# Altium project Doom_computer_PCB.PrjPcb
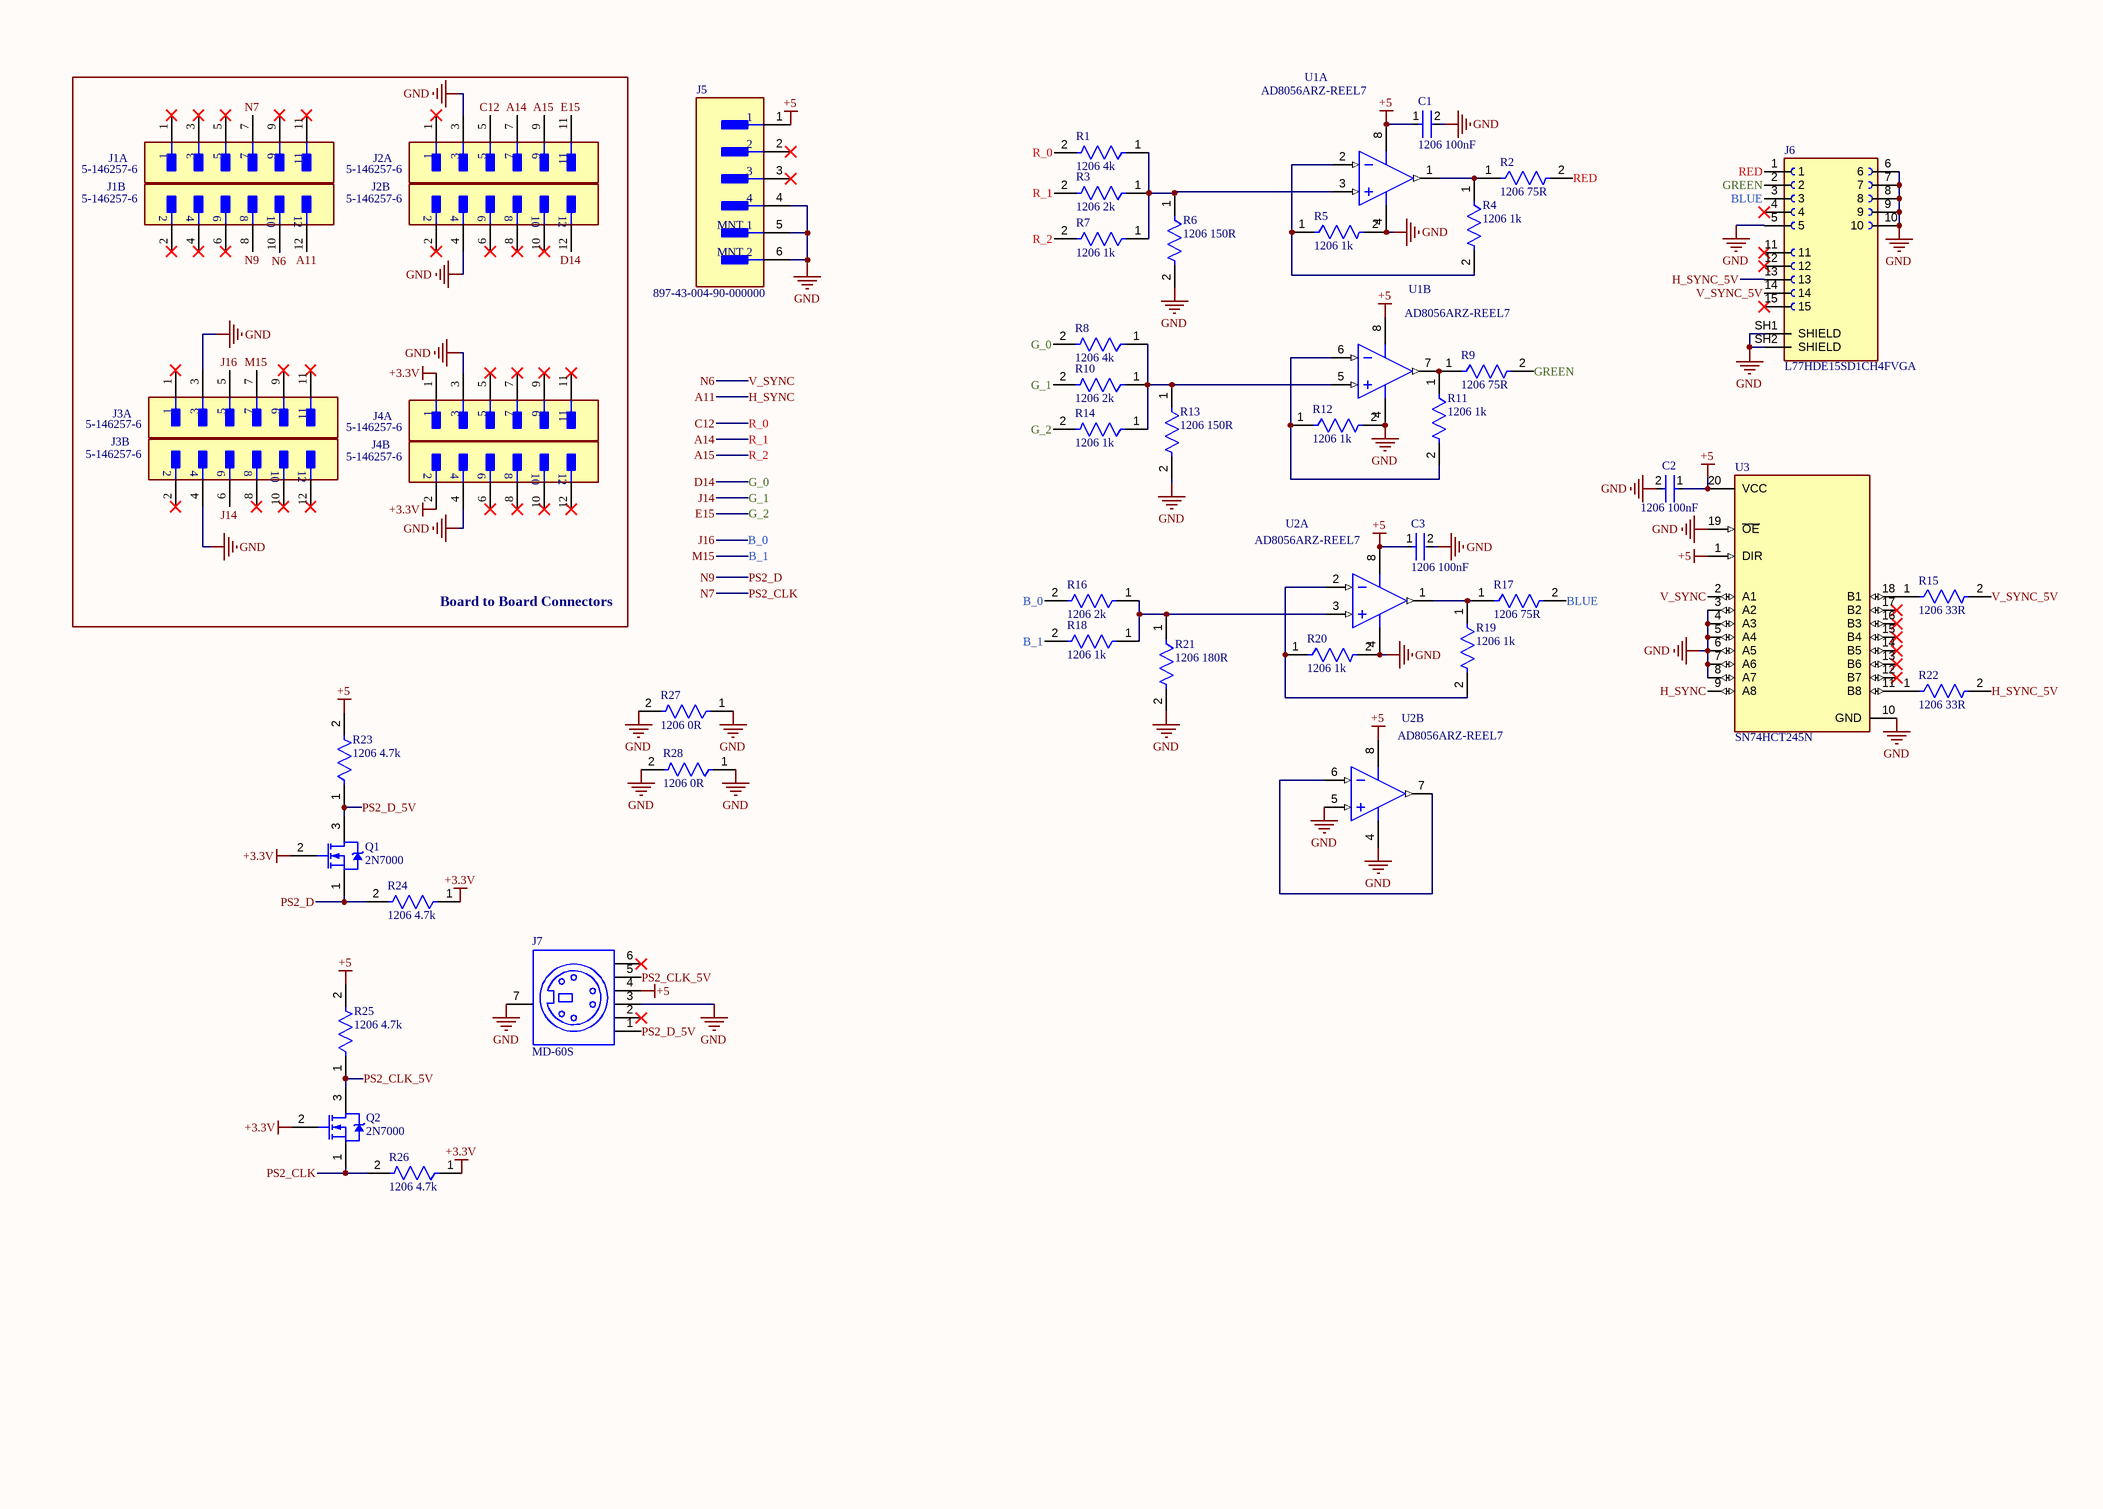
[diagram p0: Main.SchDoc]
1 sheet, 43 parts. Net scope: global (net labels, ports and power ports of the same name join across sheets).
Board file: PCB1.PcbDoc

## Sheet Main.SchDoc
size A3; SheetNumber: 1; SheetTotal: 1

### Parts
C1  1206 100nF  [FP-1206-L_3_2_0_2-W_1_6_0-MFG]
C2  1206 100nF  [FP-1206-L_3_2_0_2-W_1_6_0-MFG]
C3  1206 100nF  [FP-1206-L_3_2_0_2-W_1_6_0-MFG]
J1  5-146257-6  [FP-5-146257-6-MFG]  (parts A,B of 2)
J2  5-146257-6  [FP-5-146257-6-MFG]  (parts A,B of 2)
J3  5-146257-6  [FP-5-146257-6-MFG]  (parts A,B of 2)
J4  5-146257-6  [FP-5-146257-6-MFG]  (parts A,B of 2)
J5  897-43-004-90-000000  [FP-897-43-004-90-000000-MFG]
J6  L77HDE15SD1CH4FVGA  [AMPHENOL_L77HDE15SD1CH4FVGA]
J7  MD-60S  [CUI-MD-60S_V]
Q1  2N7000  [ONSC-TO-92-3-29-11]
Q2  2N7000  [ONSC-TO-92-3-29-11]
R1  1206 4k  [FP-RMCF1206-MFG]
R2  1206 75R  [FP-RMCF1206-MFG]
R3  1206 2k  [FP-RMCF1206-MFG]
R4  1206 1k  [FP-RMCF1206-MFG]
R5  1206 1k  [FP-RMCF1206-MFG]
R6  1206 150R  [FP-RMCF1206-MFG]
R7  1206 1k  [FP-RMCF1206-MFG]
R8  1206 4k  [FP-RMCF1206-MFG]
R9  1206 75R  [FP-RMCF1206-MFG]
R10  1206 2k  [FP-RMCF1206-MFG]
R11  1206 1k  [FP-RMCF1206-MFG]
R12  1206 1k  [FP-RMCF1206-MFG]
R13  1206 150R  [FP-RMCF1206-MFG]
R14  1206 1k  [FP-RMCF1206-MFG]
R15  1206 33R  [FP-RMCF1206-MFG]
R16  1206 2k  [FP-RMCF1206-MFG]
R17  1206 75R  [FP-RMCF1206-MFG]
R18  1206 1k  [FP-RMCF1206-MFG]
R19  1206 1k  [FP-RMCF1206-MFG]
R20  1206 1k  [FP-RMCF1206-MFG]
R21  1206 180R  [FP-RMCF1206-MFG]
R22  1206 33R  [FP-RMCF1206-MFG]
R23  1206 4.7k  [FP-RMCF1206-MFG]
R24  1206 4.7k  [FP-RMCF1206-MFG]
R25  1206 4.7k  [FP-RMCF1206-MFG]
R26  1206 4.7k  [FP-RMCF1206-MFG]
R27  1206 0R  [FP-RMCF1206-MFG]
R28  1206 0R  [FP-RMCF1206-MFG]
U1  AD8056ARZ-REEL7  [ADI-R-8_M]  (parts A,B of 2)
U2  AD8056ARZ-REEL7  [ADI-R-8_M]  (parts A,B of 2)
U3  SN74HCT245N  [FP-SN74HCT245N-MFG]

### Blocks framed on the sheet
Board to Board Connectors: J1-J4

### Nets
+3.3V: J4.1 J4.2 Q1.2(G) Q2.2(G) R24.1 R26.1
+5: C1.1 C2.1 C3.1 J5.1 J7.4 R23.2 R25.2 U1.8(+VS) U2.8(+VS) U3.1(DIR) U3.20(VCC)
GND: C1.2 C2.2 C3.2 J2.3 J2.4 J3.3 J3.4 J4.3 J4.4 J5.4 J5.5(MNT_1) J5.6(MNT_2) J6.5 J6.6 J6.7 J6.8 J6.9 J6.10 J6.SH1(SHIELD) J6.SH2(SHIELD) J7.3 J7.7 R5.2 R6.2 R12.2 R13.2 R20.2 R21.2 R27.1 R27.2 R28.1 R28.2 U1.4(-VS) U2.4(-VS) U2.5(+IN_2) U3.3(A2) U3.4(A3) U3.5(A4) U3.6(A5) U3.7(A6) U3.8(A7) U3.10(GND) U3.19(~{OE})
A11: J1.12 U3.9(A8)  [also labelled H_SYNC]
A14: J2.7 R3.2  [also labelled R_1]
A15: J2.9 R7.2  [also labelled R_2]
B_0: J3.5 R16.2  [also labelled J16]
B_1: J3.7 R18.2  [also labelled M15]
BLUE: J6.3 R17.2
C12: J2.5 R1.2  [also labelled R_0]
D14: J2.12 R8.2  [also labelled G_0]
E15: J2.11 R14.2  [also labelled G_2]
G_1: J3.6 R10.2  [also labelled J14]
GREEN: J6.2 R9.2
H_SYNC_5V: J6.13 R22.2
N6: J1.10 U3.2(A1)  [also labelled V_SYNC]
N7: J1.7 Q2.1(S) R26.2  [also labelled PS2_CLK]
N9: J1.8 Q1.1(S) R24.2  [also labelled PS2_D]
PS2_CLK_5V: J7.5 Q2.3(D) R25.1
PS2_D_5V: J7.1 Q1.3(D) R23.1
RED: J6.1 R2.2
V_SYNC_5V: J6.14 R15.2
NetR1_1: R1.1 R3.1 R6.1 R7.1 U1.3(+IN_1)
NetR2_1: R2.1 R4.1 U1.1(OUT_1)
NetR4_2: R4.2 R5.1 U1.2(-IN_1)
NetR8_1: R8.1 R10.1 R13.1 R14.1 U1.5(+IN_2)
NetR9_1: R9.1 R11.1 U1.7(OUT_2)
NetR11_2: R11.2 R12.1 U1.6(-IN_2)
NetR15_1: R15.1 U3.18(B1)
NetR16_1: R16.1 R18.1 R21.1 U2.3(+IN_1)
NetR17_1: R17.1 R19.1 U2.1(OUT_1)
NetR19_2: R19.2 R20.1 U2.2(-IN_1)
NetR22_1: R22.1 U3.11(B8)
NetU2_6: U2.6(-IN_2) U2.7(OUT_2)

Not connected (* = marked no-connect by the designer): J1 1* 2* 3* 4* 5* 6* 9* 11*; J2 1* 2* 6* 8* 10*; J3 1* 2* 8* 9* 10* 11* 12*; J4 5* 6* 7* 8* 9* 10* 11* 12*; J5 2* 3*; J6 4* 11* 12* 15*; J7 2* 6*; U3 12(B7)* 13(B6)* 14(B5)* 15(B4)* 16(B3)* 17(B2)*

### Notes on the sheet
- THIS DOCUMENT AND THE DATA DISCLOSED HEREIN OR
- HEREWITH IS THE PROPERTY OF ALTIUM LIMITED AND MAY
- DWG NO:
- REVISION
- REV:
- DESCRIPTION
- DATE
- APPROVED
- BE FREELY DISTRIBUTED IN WHOLE. NO RIGHTS ARE
- RESERVED OR EXPRESS OR IMPLIED WARANTEE GIVEN.
- ENG:
- APPROVALS
- PROJECT
- DSN:
- CHK:
- REFERENCE DOCUMENTS
- PROJECT REVISION:
- TITLE
- DOCUMENT REVISION:
- DESIGN ITEM:
- BOM:
- FAB DWG:
- PCB DWG:
- ASSY DWG:
- SCALE:
- A3
- SIZE
- CAGE CODE
- FILE NAME
- DWG NO.
- SHEET
- OF
- REV

### Library data of the parts
C1-C3 = CMP-04427-012732-1: Automotive Ceramic Capacitor, 1206, 100nF, 10%, X8R, 15%, 50V; RoHS Compliant: Yes
J1-J4 = CMP-03369-000148-1: CONN HEADER VERT 12POS 2.54MM; Gasket: No (Without); Voltage Rating: 750V; Insulation Resistance: 5GR; Keyed: No; PCB Mount Retention: Without; Approvals: CSA; High Temperature Housing: Yes; Board Standoff: Yes (With); Contact Current Rating: 3A; Number of Contacts: 12; PCB Thickness: 0.062inch; Contact Post Length: 0.12inch; PCB Mounting Orientation: Vertical; Connector Type: Plug; Housing Color: Black; Package Quantity: 240; Orientation: Straight; Mating Connector Lock: No (Without); Radiation Hardening: No; Stabilizers: No (Without); Pitch: 2.54mm; Contact Plating: Gold; Contact Gender: Male; Mount: Through Hole; Length: 14.83mm; Depth: 4.88mm; ELV: Compliant; Color: Black; Insulation Color: Black; Max Operating Temperature: 105°C; Contact Material: Bronze; Current Rating: 3A; Housing Material: Thermoplastic; Packaging: Carton; Mating Alignment: No (Without); Number of Rows: 2; Contact Finish - Mating: GOLD; Termination: Through Hole; Fastening Type: Pull; Contact Mating Length: 0.23inch; Number of Positions: 12; Contact Type: Male Pin; RoHS Compliant: Yes; Row Spacing: 2.54mm; Series: AMPMODU MOD II; Min Operating Temperature: -65°C; Contact Protection: No (Without); Flammability Rating: UL94 V-0; High Speed Serial Data Connector: No; Insulation Material: Polymer; Contact Shape: Square; Selectively Loaded: No (Without); Strain Relief: No (Without)
J5 = CMP-07782-000001-1: CONN RCPT USB2.0 TYPEB 4POS R/A; Max Voltage Rating (AC): 30V; Number of Positions: 4; Gender: Receptacle; Connector Type: USB; Number of Ports: 1; Insulation Resistance: 1GR; Max Current Rating: 1A; Lead Free: Lead Free; Contact Plating: Gold; Flammability Rating: UL94 V-0; Length: 12.03mm; Depth: 16mm; Packaging: Tray; Mount: Through Hole; Termination: Through Hole; Number of Terminals: 4; Package Quantity: 150; Contact Material: Copper Alloy; Housing Material: Thermoplastic; Number of Contacts: 4; USB Standard: USB 2.0; Orientation: Right Angle; REACH SVHC: No SVHC
J6 = CMP-002-00071-1: Dsub, Stamped Signal 3A, High Density, Right Angle PCB Thru Hole, FP=8.89mm (0.35Î¼in), 15 Socket, Bright Tin Shell, Flash Gold, 4-40 Removable Front Screwlock, Ground Tab with Boardlock, VGA; MF: Amphenol Commercial; Value: *; MP: L77HDE15SD1CH4FVGA; Check_prices: https://www.snapeda.com/parts/L77HDE15SD1CH4FVGA/Amphenol/view-part/?ref=eda; Pins: 17; Source: L77HDE15SD1CH4FVGA.SchLib; Component Type: Standard; Case/Package: None; Design Item ID: L77HDE15SD1CH4FVGA; SnapEDA_Link: https://www.snapeda.com/parts/L77HDE15SD1CH4FVGA/Amphenol/view-part/?ref=snap
J7 = CMP-2000-06691-1: Right Angle Mini DIN Connector, 100 Vac, 12 Vdc, -40 to 85 degC, 6-Pin THD, RoHS, Bulk; Manufacturer: CUI Inc; Online Catalog: MD; Other Names: 045-0036RCP-2460MD60S; Connector Type: Receptacle,FemaleSockets; Mating Products: CP-2060-ND-CONNMINI-DIN6PINMALE; Number of Positions: 6; Current Rating: 1A,2A; Voltage - Rated: 100VAC,12VDC; Category: Connectors,Interconnects; Standard Package: 300; Mounting Technology: ThroughHole; RoHS Information: MD-x0SCertofCompliance; Operating Temperature: -40°C~85°C; Contact Finish: Silver; Orientation: Keyed; Package Reference: MD-60S; Package Description: 6-Pin Through Hole Device, Body 14 x 12.4 mm, Height 13.1 mm; Shell Material, Finish: PolybutyleneTerephthalate(PBT); Packaging: Bulk; Fastening Type: Push-Pull; Contact Finish Thickness: -; Shell Size, MIL: -; Termination: Solder; Manufacturer URL: http://www.cui.com/; Family: CircularConnectors; Series: MD; Mounting Type: ThroughHole,RightAngle; Features: -; Ingress Protection: -; Datasheet Version: Rev. 1.02, 03/2012; 3D Model: MD-60S; Datasheet URL: http://www.cui.com/product/resource/md-xxs.pdf; Shell Size - Insert: MiniDIN
Q1 Q2 = CMP-1058-00936-1: Small Signal MOSFET, 200 mA, 60 V, N-Channel, 3-Pin TO-92, Bulk Box; Manufacturer: On Semiconductor; Ciss Typ (pF): 60; VGS(th) Max (V): 3; Crss Typ (pF): 5; Channel Polarity: N Channel; VGS Max (V): 20; Configuration: Single; PD Max (W): 0.35; Coss Typ (pF): 25; ID Max (A): 0.2; PackageVersion: Rev. AM; ComponentLink3URL: http://www.onsemi.cn/pub_link/Collateral/2N6426-D.PDF; ComponentLink2URL: http://www.onsemi.com/pub_link/Collateral/2N7000-D.PDF; DatasheetVersion: Rev. 8; Mounting Technology: Through Hole; V(BR)DSS Min (V): 60; PartNumber: 2N7000; PackageDescription: 3-Pin Transistor Outline, Body 4.825 x 3.685 mm, Pitch 1.27 mm; ComponentLink2Description: Datasheet; ComponentLink1URL: http://www.onsemi.com/; PackageReference: TO-92-3-29-11_AM_SL; Packing: Bulk Box; ComponentLink1Description: Manufacturer URL; Package Type: TO-92; ComponentLink3Description: Package Specification
R1-R22 R27 R28 = CMP-26527-000352-1: 1206; Max Power Dissipation: 250mW; Tolerance: 5%; Resistance: 4.7kR; Temperature Coefficient: 200ppm/°C; Case Code (Metric): 3216; Width: 0.063inch; Contact Plating: Tin; Features: Automotive AEC-Q200; RoHS Compliant: Yes; Case/Package: 1206; Number of Terminations: 2; Min Operating Temperature: -55°C; Radiation Hardening: No; Length: 0.126inch; Mount: Surface Mount; Max Operating Temperature: 155°C; Packaging: Tape and Reel; Series: RMCF; Height: 0.028inch; Resistor Type: Thick Film; Case Code (Imperial): 1206
R23-R26 = CMP-26527-000352-1: 4.7kΩ ±5% 0.25W 1206 Thick Film Chip Resistor AEC-Q200 compliant; Max Power Dissipation: 250mW; Resistance: 4.7kR; Temperature Coefficient: 200ppm/°C; Case Code (Metric): 3216; Width: 0.063inch; Contact Plating: Tin; Features: Automotive AEC-Q200; RoHS Compliant: Yes; Case/Package: 1206; Number of Terminations: 2; Tolerance: 5%; Min Operating Temperature: -55°C; Radiation Hardening: No; Length: 0.126inch; Mount: Surface Mount; Max Operating Temperature: 155°C; Packaging: Tape and Reel; Series: RMCF; Height: 0.028inch; Resistor Type: Thick Film; Case Code (Imperial): 1206
U1 U2 = CMP-0384-01085-1: Double Channel Low Power Operational Amplifier, 300 MHz BW, 1.4 KV/us SR, Industrial, 8-pin SOIC (R-8), Reel; Generic Part Number: AD8056; Manufacturer: Analog Devices; V Span Max: 12V; Input Offset Voltage: 3mV; Iq/Amp: 6mA; V Span Min: 8V; Small Signal Bandwidth: 300MHz; Amplifiers Per Package: 2; Input Bias Current: 400nA; Packing: Reel; Code_JEDEC: MS-012-AA; ComponentLink2URL: http://www.analog.com/static/imported-files/data_sheets/AD8055_8056.pdf; DatasheetVersion: Rev. J; Slew Rate: 1.4KV/us; ComponentLink3Description: Package Specification; ComponentLink2Description: Datasheet; ComponentLink3URL: http://www.analog.com/static/imported-files/packages/PKG_PDF/SOIC_Narrow%20(R)/R_8.pdf; PackageReference: R-8; PackageVersion: 060506-A; Mounting Technology: Surface Mount; PartNumber: AD8056ARZ-REEL7; ComponentLink1URL: http://www.analog.com/en/index.html; ComponentLink1Description: Manufacturer URL; PackageDescription: 8-Pin Standard Small Outline Package, Body 3.9 x 4.9 mm, Pitch 1.27 mm
U3 = CMP-1620-00425-3: IC TXRX NON-INVERT 5.5V 20DIP; Manufacturer: Texas Instruments; Propagation Delay: 20ns; Logic Function Desc: Non-Inverting; Nominal Supply Current: 8-80uA; Number Of Inputs: 2; Number Of Circuits: 8; Max Junction Temp: +150°C; Min Supply Voltage: 4.5V; Standoff Height: 0.51mm; Temperature Range Low: -40°C; Octopart: https://octopart.com/sn74hct245n-texas+instruments-517043; Manufacturer Part Number: SN74HCT245N; Temperature Range High: +85°C; ComponentLink2URL: http://www.ti.com/lit/ds/symlink/sn74hct245.pdf; Temperature: -40°C to +85°C; Category: IC; Package: SN74HCT245N; Device Class L1: Integrated Circuits (ICs); Device Class L2: Logic ICs; Ambient Temperature Range High: +85°C; Ambient Temperature Range Low: -40°C; Digikey Description: IC TXRX NON-INVERT 5.5V 20DIP; Max Supply Voltage: 5.5V; Automotive: No; RoHS: TRUE; Lead Free: Yes; Device Class L3: Drivers and Transceivers; Ipc Land Pattern Name: DIP794W46P254L2540H508Q20; ComponentLink2Description: Datasheet; Number Of Outputs: 2; Height: 5.08mm; Mouser Description: Bus Transceivers Tri-State Octal Bus